# Altium schematic sheet STM32RF_NRF.SchDoc
size A4; SheetNumber: 4; SheetTotal: 5
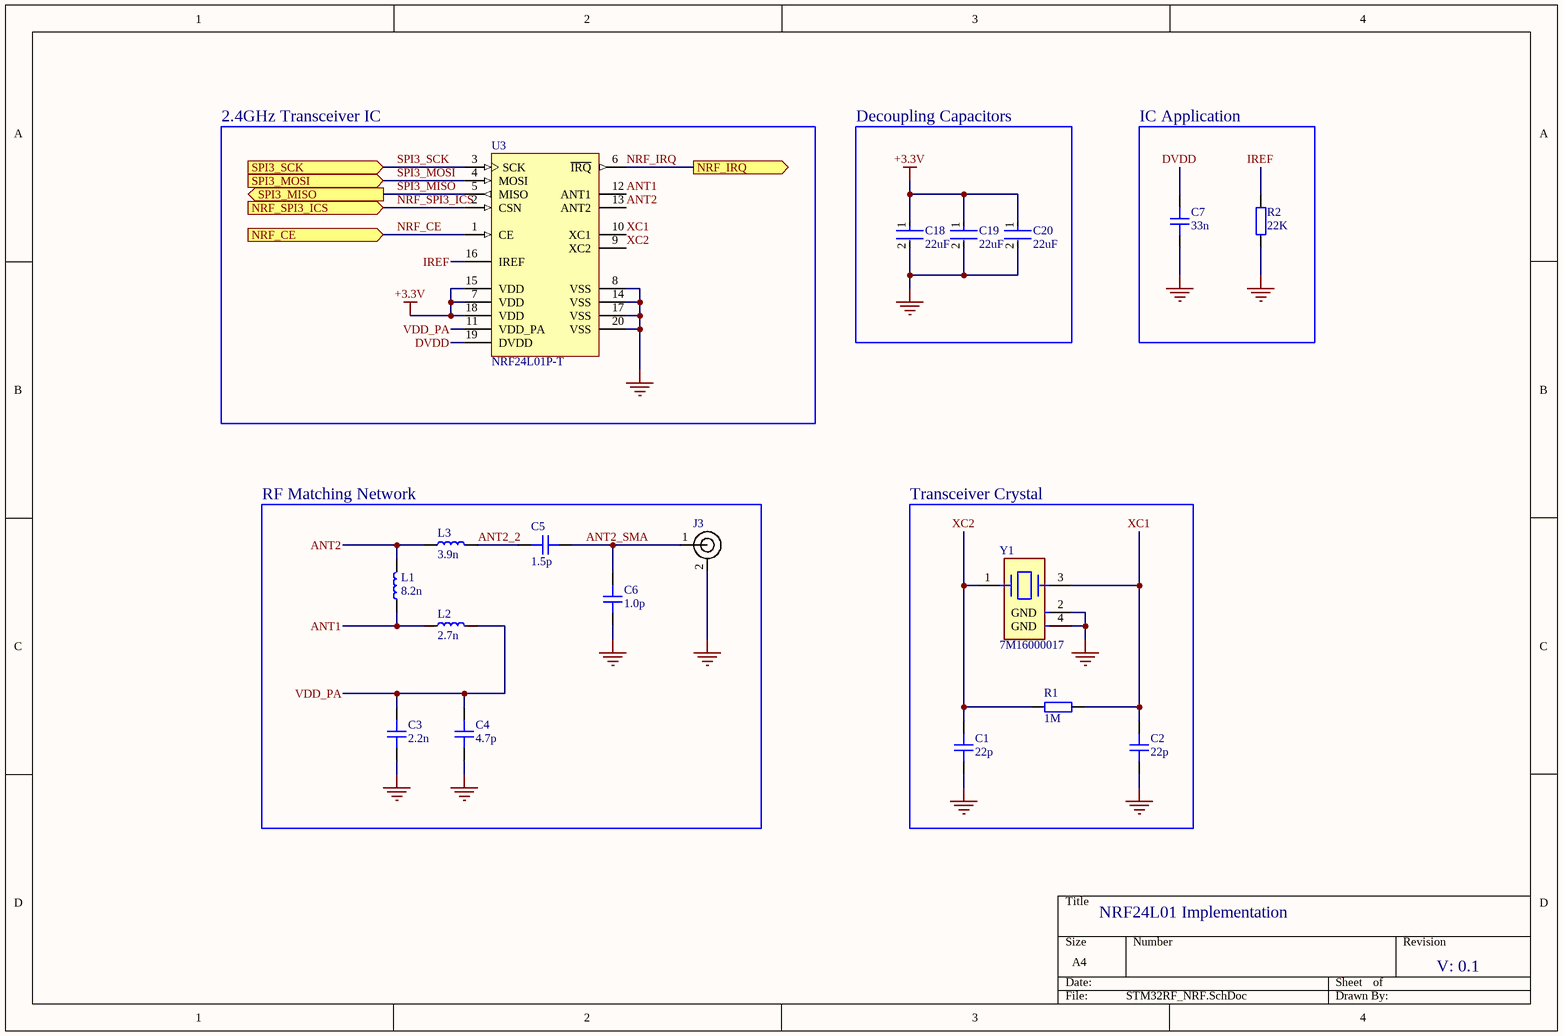
[diagram p0: STM32RF_NRF.SchDoc]

## Parts
C1  22p  [CAP_0402]
C2  22p  [CAP_0402]
C3  2.2n  [CAP_0402]
C4  4.7p  [CAP_0402]
C5  1.5p  [CAP_0402]
C6  1.0p  [CAP_0402]
C7  33n  [CAP_0402]
C18  22uF  [FP-GRM158-0_2-MFG]
C19  22uF  [FP-GRM158-0_2-MFG]
C20  22uF  [FP-GRM158-0_2-MFG]
J3  CON-SMA-EDGE-S  [CON-SMA-EDGE-S]  (value not drawn)
L1  8.2n  [IND_0402]
L2  2.7n  [IND_0402]
L3  3.9n  [IND_0402]
R1  1M  [RES_0402]
R2  22K  [RES_0402]
U3  NRF24L01P-T  [NRSC-QFN-20_L]
Y1  7M16000017  [FP-7M-MFG]

## Blocks framed on the sheet
2.4GHz Transceiver IC: U3
Decoupling Capacitors: C18-C20
IC Application: C7 R2
RF Matching Network: C3-C6 J3 L1-L3
Transceiver Crystal: C1 C2 R1 Y1

## Ports
NRF_CE (in, see STM32RF_TopLevel[3C], STM32RF_MCU[2B]), NRF_IRQ (out, see STM32RF_TopLevel[3C], STM32RF_MCU[1B]), NRF_SPI3_ICS (in, see STM32RF_TopLevel[3B], STM32RF_MCU[2B]), SPI3_MISO (out, see STM32RF_TopLevel[3B], STM32RF_MCU[2B]), SPI3_MOSI (in, see STM32RF_TopLevel[3B], STM32RF_MCU[2B]), SPI3_SCK (in, see STM32RF_TopLevel[3B], STM32RF_MCU[2A])

## Nets
+3.3V: C18.1 C19.1 C20.1 U3.7(VDD) U3.15(VDD) U3.18(VDD)
GND: C1.1 C2.1 C3.1 C4.1 C6.1 C7.1 C18.2 C19.2 C20.2 J3.2 R2.1 U3.8(VSS) U3.14(VSS) U3.17(VSS) U3.20(VSS) Y1.2(GND) Y1.4(GND)
ANT1: L1.1 L2.1 U3.12(ANT1)
ANT2: L1.2 L3.1 U3.13(ANT2)
ANT2_2: C5.2 L3.2
ANT2_SMA: C5.1 C6.2 J3.1
DVDD: C7.2 U3.19(DVDD)
IREF: R2.2 U3.16(IREF)
NRF_CE: U3.1(CE) ; port NRF_CE
NRF_IRQ: U3.6(~{IRQ}) ; port NRF_IRQ
NRF_SPI3_ICS: U3.2(CSN) ; port NRF_SPI3_ICS
SPI3_MISO: U3.5(MISO) ; port SPI3_MISO
SPI3_MOSI: U3.4(MOSI) ; port SPI3_MOSI
SPI3_SCK: U3.3(SCK) ; port SPI3_SCK
VDD_PA: C3.2 C4.2 L2.2 U3.11(VDD_PA)
XC1: C2.2 R1.2 U3.10(XC1) Y1.3
XC2: C1.2 R1.1 U3.9(XC2) Y1.1

## Notes on the sheet
- NRF24L01 Implementation
- V: 0.1

## Library data of the parts
C1-C7 = CAP_0402: Capacitor SMD 0402; Manufacturer: *; Manufacturer Part Number: *; Distributor Link: *; LCSC: *; Rating: *; Dielectric: *
C18-C20 = CMP-06035-020400-1: Chip Multilayer Ceramic Capacitors for General Purpose, 0402, 22uF, X5R, 15%, 20%, 10V
J3 = CON-SMA-EDGE-S: RF Connector SMA Female 50 Ohms 18 GHz PCB Edge Mount; Manufacturer: RF Solutions; Manufacturer Part Number: CON-SMA-EDGE-S
L1-L3 = IND_0402: Inductor SMD 0402
R1 R2 = RES_0402: Resistor SMD 0402; Manufacturer: *; Manufacturer Part Number: *; Distributor Link: *; LCSC: *
U3 = CMP-2000-06859-1: Single Chip Transceiver, 2.4 GHz, 60 mW, 1.9 to 3.6 V, -40 to 85 degC, 20-Pin QFN, RoHS, Tray; Manufacturer: Nordic Semiconductor; Data Rate (Max): 2Mbps; Current - Transmitting: 7mA~11.3mA; Power - Output: 0dBm; Other Names: 1490-1019; Online Catalog: nRF24L01+; Current - Receiving: 12.6mA~13.5mA; For Use With: 1490-1002-ND-KITEVALUATIONNRF24L01P1568-1295-ND-SPARKFUNTRANSCEIVERBREAKOUT-1568-1296-ND-SPARKFUNTRANSCEIVERBREAKOUT-1471-1410-ND-DEVBOARDNRFSCLICKNRF24L01P-MODULE-PCB-ND-KITEVALNRF24L01+PCBANTENNANRF24L01P-MODULE-SMA-ND-KITEVALNRF24L01+SMACONNNRF24L01P-UPGRADE-ND-UPGRADE2PCB/1SMANRF24L01103990038-ND-DEVDUINOSENSORNODEV1.3103990053-ND-DEVDUINOSENSORNODEV2(ATMEGA103990074-ND-DEVDUINOSENSORNODE106990026-ND-ENERGYMONITORSHIELDV2113990088-ND-WIRELESSGATESHIELD113990095-ND-DEVDUINOSENSORNODEV3(ATMEGA106030001-ND-ENERGYMONITORSHIELD1597-1361-ND-DEVDUINOSENSORNODEV2.2(ATMEG105990030-ND-RGBWSTRIPWIRELESSSHIELDV1.0; Frequency: 2.4GHz; Design Resources: DevelopmentToolSelector; RF Family/Standard: GeneralISM>1GHZ; Serial Interfaces: SPI; Sensitivity: -94dBm; Voltage - Supply: 1.9V~3.6V; Modulation: GFSK; GPIO: -; Package Reference: QFN20; Memory Size: -; Category: RF/IFandRFID; Type: TxRxOnly; Standard Package: 490; Package / Case: 20-VFQFNExposedPad; Packaging: Tray; Series: -; Package Description: 20-Pin Quad Flat No-lead Package, Body 4 x 4 mm, Pitch 0.5 mm; Datasheet Version: Rev. 1.0, 09/2008; Protocol: -; Manufacturer URL: http://www.nordicsemi.com/eng/Products/; Operating Temperature: -40°C~85°C; Family: RFTransceiverICs; Datasheet URL: http://www.nordicsemi.com/eng/content/download/2726/34069/file/nRF24L01P_Product_Specification_1_0.pdf; Mounting Technology: SurfaceMount
Y1 = CMP-18717-000287-1: Crystal 16MHz, 10ppm, 9pF, 60Ω; ESR (Equivalent Series Resistance): 50R; Packaging: Tape and Reel; Frequency: 16MHz; Min Operating Temperature: -20°C; Length: 0.126inch; Height: 0.031inch; Frequency Stability: 10ppm; Frequency Tolerance: 10ppm; Max Operating Temperature: 75°C; Case/Package: SMD/SMT; Load Capacitance: 9pF; Mount: Surface Mount; Width: 0.098inch